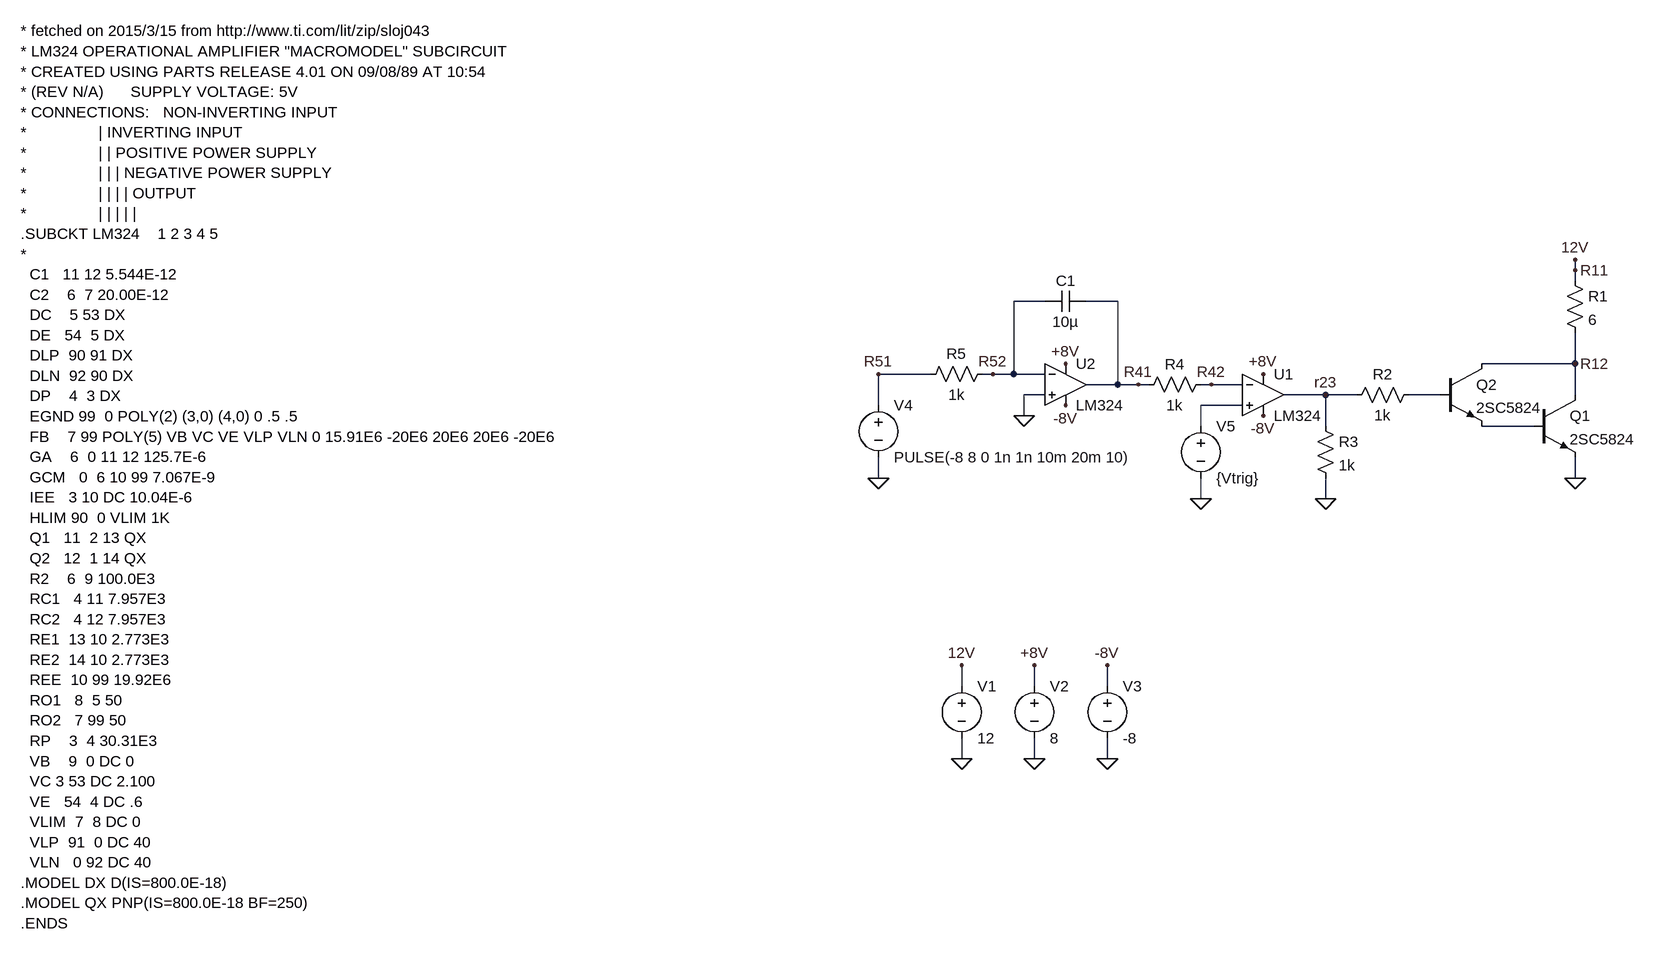
[diagram p0: schematic aufgabe2.asc]
aufgabe2.asc, the LTspice schematic file:
Version 4
SHEET 1 1360 680
WIRE 672 -304 672 -320
WIRE 672 -288 672 -304
WIRE -144 -256 -192 -256
WIRE -32 -256 -80 -256
WIRE 672 -160 672 -208
WIRE 672 -160 528 -160
WIRE -320 -144 -400 -144
WIRE -224 -144 -240 -144
WIRE -192 -144 -192 -256
WIRE -192 -144 -224 -144
WIRE -144 -144 -192 -144
WIRE -32 -128 -32 -256
WIRE -32 -128 -80 -128
WIRE 0 -128 -32 -128
WIRE 16 -128 0 -128
WIRE 112 -128 96 -128
WIRE 160 -128 112 -128
WIRE -144 -112 -176 -112
WIRE 288 -112 224 -112
WIRE 336 -112 288 -112
WIRE 464 -112 416 -112
WIRE 672 -112 672 -160
WIRE -400 -96 -400 -144
WIRE 160 -96 96 -96
WIRE -176 -80 -176 -112
WIRE 96 -64 96 -96
WIRE 288 -64 288 -112
WIRE 608 -64 528 -64
WIRE -400 16 -400 -16
WIRE 672 16 672 -16
WIRE 96 48 96 16
WIRE 288 48 288 16
WIRE -272 336 -272 304
WIRE -160 336 -160 304
WIRE -48 336 -48 304
WIRE -272 448 -272 416
WIRE -160 448 -160 416
WIRE -48 448 -48 416
FLAG -272 448 0
FLAG -160 448 0
FLAG -48 448 0
FLAG -272 304 12V
FLAG -160 304 +8V
FLAG -48 304 -8V
FLAG 192 -80 -8V
FLAG 192 -144 +8V
FLAG -112 -96 -8V
FLAG -112 -160 +8V
FLAG 672 16 0
FLAG 672 -320 12V
FLAG 288 48 0
FLAG 96 48 0
FLAG -400 16 0
FLAG -176 -80 0
FLAG -400 -144 R51
FLAG -224 -144 R52
FLAG 0 -128 R41
FLAG 112 -128 R42
FLAG 288 -112 r23
FLAG 672 -304 R11
FLAG 672 -160 R12
SYMBOL res 656 -304 R0
SYMATTR InstName R1
SYMATTR Value 6
SYMBOL res 432 -128 R90
WINDOW 0 0 56 VBottom 2
WINDOW 3 32 56 VTop 2
SYMATTR InstName R2
SYMATTR Value 1k
SYMBOL res 272 -80 R0
SYMATTR InstName R3
SYMATTR Value 1k
SYMBOL res 112 -144 R90
WINDOW 0 0 56 VBottom 2
WINDOW 3 32 56 VTop 2
SYMATTR InstName R4
SYMATTR Value 1k
SYMBOL res -224 -160 R90
WINDOW 0 0 56 VBottom 2
WINDOW 3 32 56 VTop 2
SYMATTR InstName R5
SYMATTR Value 1k
SYMBOL cap -80 -272 R90
WINDOW 0 0 32 VBottom 2
WINDOW 3 32 32 VTop 2
SYMATTR InstName C1
SYMATTR Value 10µ
SYMATTR SpiceLine IC=4
SYMBOL npn 608 -112 R0
SYMATTR InstName Q1
SYMATTR Value 2SC5824
SYMBOL OpAmps\\opamp2 192 -176 R0
SYMATTR InstName U1
SYMATTR Value LM324
SYMATTR SpiceModel LM324
SYMBOL voltage -272 320 R0
SYMATTR InstName V1
SYMATTR Value 12
SYMBOL voltage -160 320 R0
WINDOW 123 0 0 Left 0
WINDOW 39 0 0 Left 0
SYMATTR InstName V2
SYMATTR Value 8
SYMBOL voltage -48 320 R0
SYMATTR InstName V3
SYMATTR Value -8
SYMBOL voltage -400 -112 R0
WINDOW 123 0 0 Left 0
WINDOW 39 0 0 Left 0
SYMATTR InstName V4
SYMATTR Value PULSE(-8 8 0 1n 1n 10m 20m 10)
SYMBOL voltage 96 -80 R0
SYMATTR InstName V5
SYMATTR Value {Vtrig}
SYMBOL OpAmps\\opamp2 -112 -192 R0
SYMATTR InstName U2
SYMATTR Value LM324
SYMATTR SpiceModel LM324
SYMBOL npn 464 -160 R0
SYMATTR InstName Q2
SYMATTR Value 2SC5824
TEXT -1720 -672 Left 2 !* fetched on 2015/3/15 from http://www.ti.com/lit/zip/sloj043\n* LM324 OPERATIONAL AMPLIFIER "MACROMODEL" SUBCIRCUIT\n* CREATED USING PARTS RELEASE 4.01 ON 09/08/89 AT 10:54\n* (REV N/A)      SUPPLY VOLTAGE: 5V\n* CONNECTIONS:   NON-INVERTING INPUT\n*                | INVERTING INPUT\n*                | | POSITIVE POWER SUPPLY\n*                | | | NEGATIVE POWER SUPPLY\n*                | | | | OUTPUT\n*                | | | | |\n.SUBCKT LM324    1 2 3 4 5\n*\n  C1   11 12 5.544E-12\n  C2    6  7 20.00E-12\n  DC    5 53 DX\n  DE   54  5 DX\n  DLP  90 91 DX\n  DLN  92 90 DX\n  DP    4  3 DX\n  EGND 99  0 POLY(2) (3,0) (4,0) 0 .5 .5\n  FB    7 99 POLY(5) VB VC VE VLP VLN 0 15.91E6 -20E6 20E6 20E6 -20E6\n  GA    6  0 11 12 125.7E-6\n  GCM   0  6 10 99 7.067E-9\n  IEE   3 10 DC 10.04E-6\n  HLIM 90  0 VLIM 1K\n  Q1   11  2 13 QX\n  Q2   12  1 14 QX\n  R2    6  9 100.0E3\n  RC1   4 11 7.957E3\n  RC2   4 12 7.957E3\n  RE1  13 10 2.773E3\n  RE2  14 10 2.773E3\n  REE  10 99 19.92E6\n  RO1   8  5 50\n  RO2   7 99 50\n  RP    3  4 30.31E3\n  VB    9  0 DC 0\n  VC 3 53 DC 2.100\n  VE   54  4 DC .6\n  VLIM  7  8 DC 0\n  VLP  91  0 DC 40\n  VLN   0 92 DC 40\n.MODEL DX D(IS=800.0E-18)\n.MODEL QX PNP(IS=800.0E-18 BF=250)\n.ENDS

The netlist it stands for:
* aufgabe2.asc
R1 R11 R12 6
R2 N001 r23 1k
R3 r23 0 1k
R4 R42 R41 1k
R5 R52 R51 1k
C1 R41 R52 10µ IC=4
Q1 R12 N003 0 0 2SC5824
XU1 N002 R42 +8V -8V r23 LM324 LM324  ; pins In+ In- V+ V- OUT
V1 R11 0 12
V2 +8V 0 8
V3 -8V 0 -8
V4 R51 0 PULSE(-8 8 0 1n 1n 10m 20m 10)
V5 N002 0 {Vtrig}
XU2 0 R52 +8V -8V R41 LM324 LM324  ; pins In+ In- V+ V- OUT
Q2 R12 N001 N003 0 2SC5824
.model NPN NPN
.model PNP PNP
.lib standard.bjt
* fetched on 2015/3/15 from http://www.ti.com/lit/zip/sloj043
* LM324 OPERATIONAL AMPLIFIER "MACROMODEL" SUBCIRCUIT
* CREATED USING PARTS RELEASE 4.01 ON 09/08/89 AT 10:54
* (REV N/A)      SUPPLY VOLTAGE: 5V
* CONNECTIONS:   NON-INVERTING INPUT
*                | INVERTING INPUT
*                | | POSITIVE POWER SUPPLY
*                | | | NEGATIVE POWER SUPPLY
*                | | | | OUTPUT
*                | | | | |
.SUBCKT LM324    1 2 3 4 5
*
  C1   11 12 5.544E-12
  C2    6  7 20.00E-12
  DC    5 53 DX
  DE   54  5 DX
  DLP  90 91 DX
  DLN  92 90 DX
  DP    4  3 DX
  EGND 99  0 POLY(2) (3,0) (4,0) 0 .5 .5
  FB    7 99 POLY(5) VB VC VE VLP VLN 0 15.91E6 -20E6 20E6 20E6 -20E6
  GA    6  0 11 12 125.7E-6
  GCM   0  6 10 99 7.067E-9
  IEE   3 10 DC 10.04E-6
  HLIM 90  0 VLIM 1K
  Q1   11  2 13 QX
  Q2   12  1 14 QX
  R2    6  9 100.0E3
  RC1   4 11 7.957E3
  RC2   4 12 7.957E3
  RE1  13 10 2.773E3
  RE2  14 10 2.773E3
  REE  10 99 19.92E6
  RO1   8  5 50
  RO2   7 99 50
  RP    3  4 30.31E3
  VB    9  0 DC 0
  VC 3 53 DC 2.100
  VE   54  4 DC .6
  VLIM  7  8 DC 0
  VLP  91  0 DC 40
  VLN   0 92 DC 40
.MODEL DX D(IS=800.0E-18)
.MODEL QX PNP(IS=800.0E-18 BF=250)
.ENDS
.backanno
.end